# EAGLE design partybooth (EAGLE 6.2)
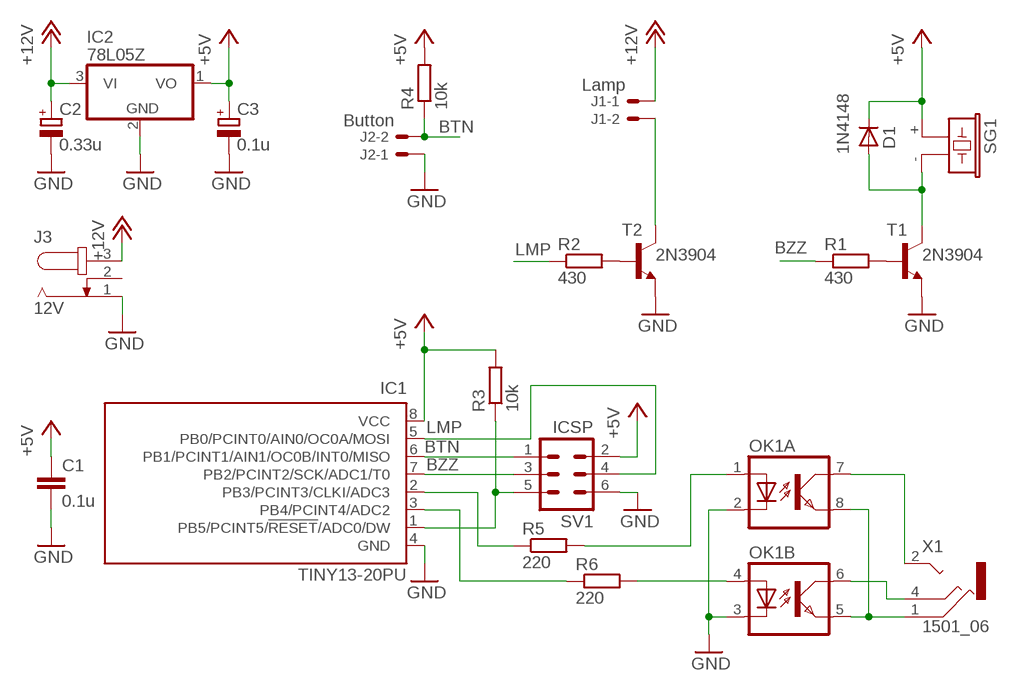
[diagram p0: schematic, sheet 1]

## Parts
C1  0.1u  C-EU050-025X075  [C050-025X075]
C2  0.33u  CPOL-EUE5-6  [E5-6]
C3  0.1u  CPOL-EUE5-5  [E5-5]
D1  1N4148  1N4148DO35-7  [DO35-7]
IC1  TINY13-20PU  [DIL08]
IC2  78L05Z  [TO92]
J1  Lamp  22-27-2021-02  [6410-02]
J2  Button  22-27-2021-02  [6410-02]
J3  12V  JACK-PLUG0  [SPC4077]
OK1  ILD2  [DIL08]
R1  430  R-EU_0204/7  [0204/7]
R2  430  R-EU_0204/7  [0204/7]
R3  10k  R-EU_0204/7  [0204/7]
R4  10k  R-EU_0204/7  [0204/7]
R5  220  R-EU_0204/7  [0204/7]
R6  220  R-EU_0204/7  [0204/7]
SG1  F/CM12P  [F/CM12P]
SV1  ICSP  MA03-2  [MA03-2]
T1  2N3904  [TO92]
T2  2N3904  [TO92]
X1  1501_06  [1501_06]

## Nets
+5V: C1.1 C3.+ D1.C IC1.8(VCC) IC2.1(VO) R3.2 R4.2 SG1.+ SV1.2
+12V: C2.+ IC2.3(VI) J1.1 J3.3
BTN: IC1.6(PB1/PCINT1/AIN1/OC0B/INT0/MISO) J2.2 R4.1 SV1.1
BZZ: IC1.7(PB2/PCINT2/SCK/ADC1/T0) R1.1 SV1.3
FOC: OK1.4(B:A) R6.2
GND: C1.2 C2.- C3.- IC1.4(GND) IC2.2(GND) J2.1 J3.1 OK1.2(A:C) OK1.3(B:C) SV1.6 T1.3(E) T2.3(E)
LMP: IC1.5(PB0/PCINT0/AIN0/OC0A/MOSI) R2.1 SV1.4
N$1: R1.2 T1.2(B)
N$2: D1.A SG1.- T1.1(C)
N$3: R2.2 T2.2(B)
N$4: J1.2 T2.1(C)
N$5: OK1.1(A:A) R5.2
N$6: IC1.1(PB5/PCINT5/!RESET!/ADC0/DW) R3.1 SV1.5
N$8: IC1.3(PB4/PCINT4/ADC2) R6.1
N$10: OK1.5(B:EMIT) OK1.8(A:EMIT) X1.1
N$11: OK1.6(B:COL) X1.4
N$12: OK1.7(A:COL) X1.2
SHT: IC1.2(PB3/PCINT3/CLKI/ADC3) R5.1
Unconnected: J3.2

## Library data of the parts
C1 = rcl:C-EU: CAPACITOR, European symbol
C2 C3 = rcl:CPOL-EU: POLARIZED CAPACITOR, European symbol
D1 = diode:1N4148: DIODE high speed (Philips)
IC1 = atmel:TINY13: 8-bit AVR Microcontroller with 1K Bytes In-System Programmable Flash Source: http://www.atmel.com/dyn/resources/prod_documents/2535S.pdf; MPN: ATTINY13-20PU; OC_FARNELL: 9171550; OC_NEWARK: 96K6521
IC2 = linear:78*: Positive VOLTAGE REGULATOR Source: http://cache.national.com/ds/LM/LM78L05.pdf http://www.fairchildsemi.com/ds/LM/LM7805.pdf
J1 J2 = con-molex:22-?-02: CONNECTOR wire to board 2.54 mm (.1 inch) pitch header; OC_FARNELL: unknown; OC_NEWARK: unknown
J3 = con-jack:JACK-PLUG: DC POWER JACK Power Jack, DC, Right Angle, Through Hole, Rated 5A at 16VDC, PC Terminals Distributor: Farnell (www.Farnell.de) Drawing: 84N1161.pdf / 84N1162.pdf Manufacturer: SPC Technology (www.spctechnology.com) Type: SPC4077 / SPC 4078; OC_FARNELL: unknown; OC_NEWARK: unknown
OK1 = optocoupler:ILD2: SIEMENS OPTO COUPLER; OC_FARNELL: 1469596; OC_NEWARK: unknown
R1-R6 = rcl:R-EU_: RESISTOR, European symbol
SG1 = buzzer:F/CM12P: BUZZER Source: Buerklin; OC_FARNELL: unknown; OC_NEWARK: unknown
SV1 = con-lstb:MA03-2: PIN HEADER; OC_FARNELL: unknown; OC_NEWARK: unknown
T1 T2 = transistor:2N3904: NPN TRANSISTOR
X1 = con-lumberg:1501_0*: Jack connectors according to JISC 6560, 2.5 mm Klinkensteckverbinder nach JISC 6560, 2,5 mm Source: http://www.lumberg.com/Produkte/PDFs/1501_05.pdfedit 1501_03 http://www.lumberg.com/Produkte/PDFs/1501_06.pdf; OC_FARNELL: 1308867; OC_NEWARK: unknown

## Board
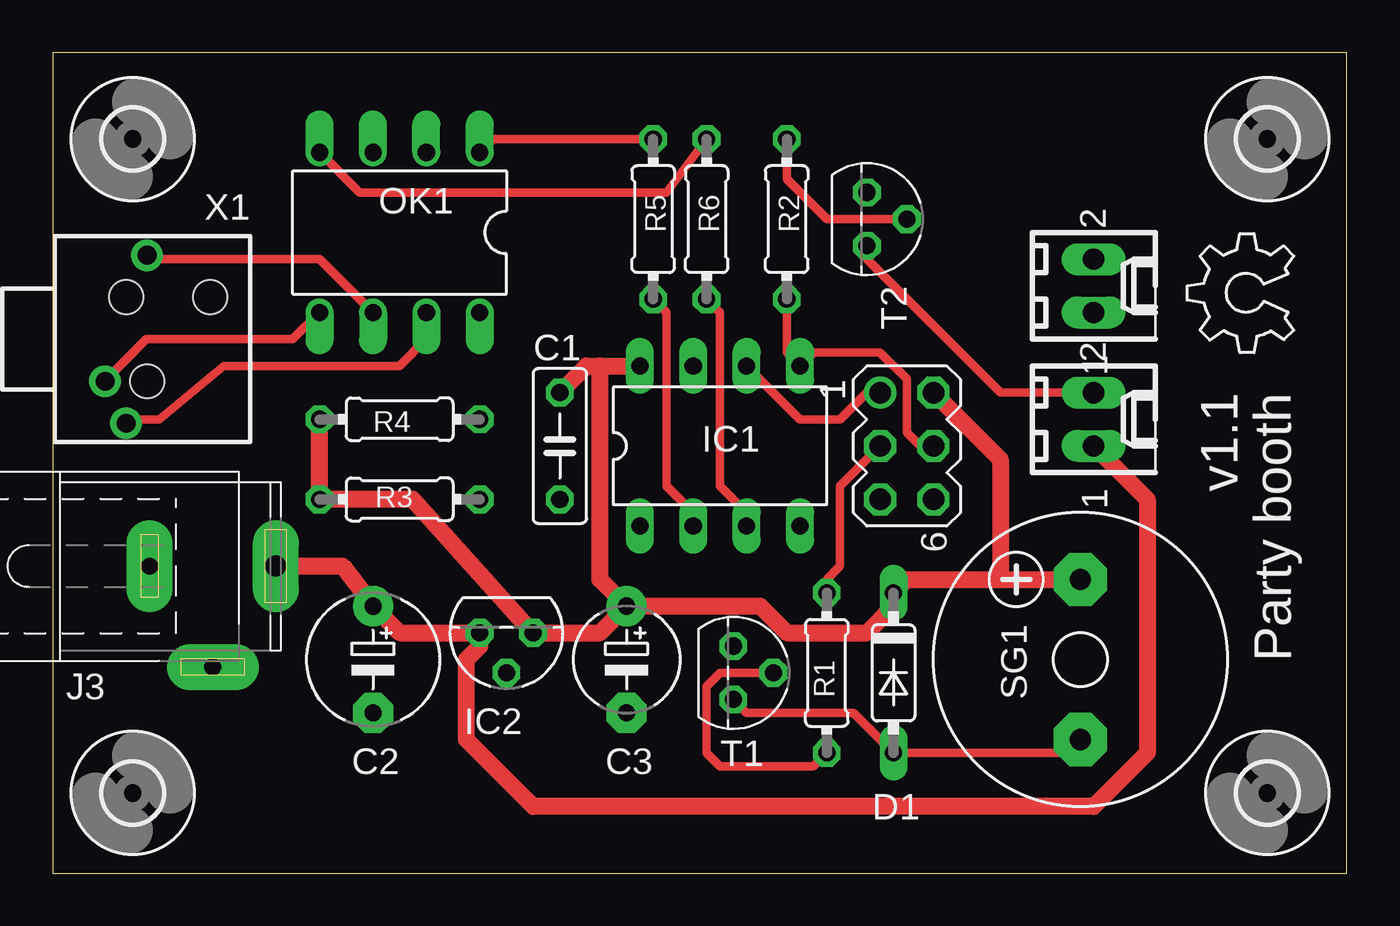
[diagram p1: board, top side]
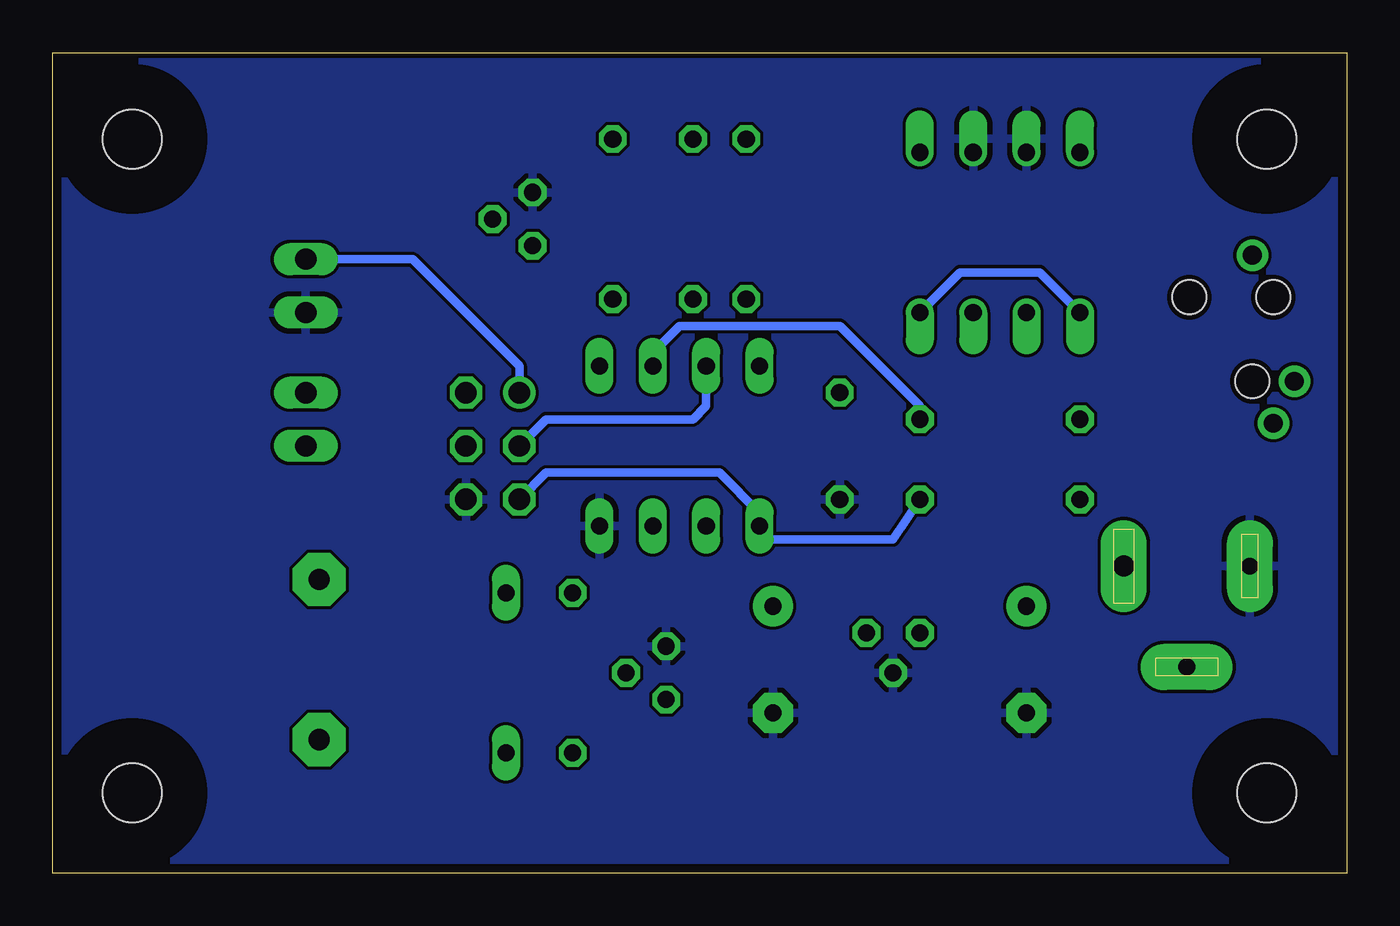
[diagram p2: board, bottom side, seen from below]

Size 61.58 x 39.04 mm. Coordinates in mm from the lower left corner, seen from the top.
Outline: 0,0 61.58,0 61.58,39.04 0,39.04 0,0
Copper layers (1*16): Top 0.035mm / dielectric 1.5mm / Bottom 0.035mm
Design rules: minimum track width 6mil, minimum drill 12mil, track to track 6mil, track to pad 6mil, pad to pad 6mil, via to via 6mil, smd to smd 0mil, copper to edge 10mil, drill to drill 10mil, minimum pad ring 10mil, minimum via ring 6mil, stop-mask expansion 2mil, vias tented up to drill 100mil, thermal gap 10mil

### Footprints (pad centres in the part's own frame; a part is rotated, then mirrored left to right if it is on the bottom)
C050-025X075 = drill 0.813 octagon: 1 -2.54,0; 2 2.54,0
E5-6 = drill 0.813 pad 1.905: + -2.54,0 | drill 0.813 pad 1.905 octagon: - 2.54,0
E5-5 = drill 0.813 pad 1.905: + -2.54,0 | drill 0.813 pad 1.905 octagon: - 2.54,0
DO35-7 = drill 0.813 long: A 3.81,0; C -3.81,0
DIL08 = drill 0.813 long: 1 -3.81,-3.81; 2 -1.27,-3.81; 3 1.27,-3.81; 4 3.81,-3.81; 5 3.81,3.81; 6 1.27,3.81; 7 -1.27,3.81; 8 -3.81,3.81
TO92 = drill 0.813 octagon: 1 -1.27,0; 2 0,1.905; 3 1.27,0
6410-02 = drill 1.016 long: 1 1.27,0; 2 -1.27,0
SPC4077 = drill 0.8 pad 2.184 long: 1 -3,0; 2 0,-4.8 | drill 1 pad 2.184 long: 3 3,0
DIL08' = drill 0.813 offset: 1 -3.81,-3.81; 2 -1.27,-3.81; 3 1.27,-3.81; 4 3.81,-3.81; 5 3.81,3.81; 6 1.27,3.81; 7 -1.27,3.81; 8 -3.81,3.81
0204/7 = drill 0.813 octagon: 1 -3.81,0; 2 3.81,0
F/CM12P = drill 1.016 pad 2.54 octagon: + 3.81,0; - -3.81,0
MA03-2 = drill 1.016: 1 -2.54,-1.27 | drill 1.016 octagon: 2 -2.54,1.27; 3 0,-1.27; 4 0,1.27; 5 2.54,-1.27; 6 2.54,1.27
TO92' = drill 0.813 octagon: 1 1.27,0; 2 0,1.905; 3 -1.27,0
2,8 = hole 2.8: 0,0
1501_06 = drill 0.9 pad 1.5: 1 -2,-2.5; 2 -4,-3.5; 4 4,-4.5 | hole 1.6: 2,-3.5; 2,-7.5; -2,-4.5

### Placement (x,y rotation side)
C1  24.13,20.32 270 top
C2  15.24,10.16 270 top
C3  27.3,10.16 270 top
D1  40.01,9.53 270 top
IC1  31.75,20.32 0 top
IC2  21.59,11.43 180 top
J1  49.53,21.59 270 top
J2  49.53,27.94 270 top
J3  7.62,14.61 0 top
OK1  [DIL08']  16.51,30.48 180 top
R1  36.83,9.53 270 top
R2  34.92,31.11 90 top
R3  16.51,17.78 180 top
R4  16.51,21.59 180 top
R5  28.57,31.11 90 top
R6  31.11,31.11 90 top
SG1  48.9,10.16 90 top
SV1  40.64,20.32 270 top
T1  2N3904  [TO92']  32.38,9.53 270 top
T2  2N3904  [TO92']  38.73,31.11 270 top
U$1  [OSHW_6X200_NOTEXT]  59.05,24.77 90 top
U$2  [2,8]  3.81,34.92 0 top
U$3  [2,8]  57.78,34.92 0 top
U$4  [2,8]  57.78,3.81 0 top
U$5  [2,8]  3.81,3.81 0 top
X1  0,25.4 90 top

### Tracks (layer width: path | path; a pad name or v marks a point on that pad's centre or on a via)
+5V
  Top 0.813: R4.2 R3.2 17.14,17.78 IC2.1 26.04,11.43 C3.+ | C1.1 25.4,24.13 26.04,24.13 | 26.04,24.13 IC1.8 | C3.+ 26.04,13.97 26.04,24.13 | C3.+ 33.66,12.7 34.92,11.43 38.73,11.43 40.01,12.7 D1.C 40.64,13.97 45.09,13.97 | 45.09,13.97 SG1.+ | SV1.2 45.09,19.68 45.09,13.97
+12V
  Top 0.813: J3.3 13.79,14.61 C2.+ 16.51,11.43 IC2.3 20.32,10.79 19.68,10.16 19.68,6.35 22.86,3.17 49.53,3.17 52.07,5.71 52.07,17.78 J1.1
BTN
  Top 0.406: IC1.6 35.56,21.59 37.47,21.59 38.73,22.86 SV1.1
  Bottom 0.406: SV1.1 39.37,24.13 44.45,29.21 J2.2 | IC1.6 33.02,24.77 31.75,26.04 24.13,26.04 20.32,22.23 R4.1
BZZ
  Top 0.406: SV1.3 37.47,18.41 37.47,14.61 36.83,13.97 R1.1
  Bottom 0.406: IC1.7 30.48,22.23 31.11,21.59 38.1,21.59 SV1.3
FOC
  Top 0.406: R6.2 29.21,32.38 14.61,32.38 OK1.4
GND
  pour Bottom: 0.64,38.73 60.96,38.73 60.96,0.64 0.64,0.64
LMP
  Top 0.406: R2.1 34.92,24.77 IC1.5 36.2,24.77 39.37,24.77 40.64,23.5 40.64,20.95 41.27,20.32 SV1.4
N$1
  Top 0.406: T1.2 31.75,9.53 31.11,8.89 31.11,5.71 31.75,5.08 36.2,5.08 R1.2
N$2
  Top 0.406: T1.1 33.02,7.62 38.1,7.62 D1.A 48.26,5.71 SG1.-
N$3
  Top 0.406: T2.2 36.83,31.11 34.92,33.02 R2.2
N$4
  Top 0.406: J1.2 45.09,22.86 38.73,29.21 T2.1
N$5
  Top 0.406: R5.2 20.95,34.92 OK1.1
N$6
  Bottom 0.406: SV1.5 38.1,19.05 29.84,19.05 27.94,17.14 IC1.1 27.94,15.88 21.59,15.88 R3.1
N$8
  Top 0.406: R6.1 31.75,26.67 31.75,18.41 33.02,17.14 IC1.3
N$10
  Top 0.406: X1.1 4.45,25.4 11.43,25.4 OK1.5
  Bottom 0.406: OK1.5 14.61,28.57 18.41,28.57 OK1.8
N$11
  Top 0.406: X1.4 4.69,29.21 12.7,29.21 OK1.6
N$12
  Top 0.406: X1.2 3.81,21.59 5.08,21.59 8.13,24.13 16.51,24.13 17.78,25.4 OK1.7
SHT
  Top 0.406: R5.1 29.21,26.67 29.21,18.41 30.48,17.14 IC1.2

### Text on the board
tPlace: v1.1 | Party booth